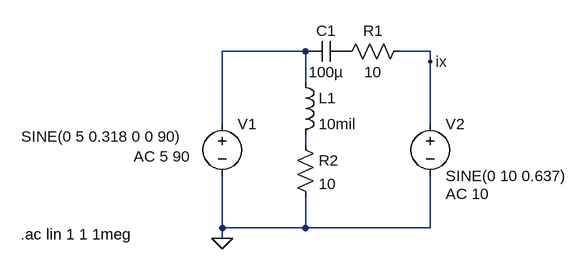
[diagram p0: schematic Task4.asc]
Task4.asc, the LTspice schematic file:
Version 4
SHEET 1 880 680
WIRE 224 48 96 48
WIRE 416 48 368 48
WIRE 416 64 416 48
WIRE 224 96 224 48
WIRE 96 160 96 48
WIRE 416 160 416 64
WIRE 224 192 224 176
WIRE 96 320 96 240
WIRE 224 320 224 272
WIRE 224 320 96 320
WIRE 416 320 416 240
WIRE 416 320 224 320
WIRE 96 336 96 320
FLAG 416 64 ix
FLAG 96 336 0
SYMBOL voltage 96 144 R0
WINDOW 3 -309 35 Left 2
WINDOW 123 -136 66 Left 2
WINDOW 39 0 0 Left 0
SYMATTR InstName V1
SYMATTR Value SINE(0 5 0.318 0 0 90)
SYMATTR Value2 AC 5 90
SYMBOL res 384 32 R90
WINDOW 0 0 56 VBottom 2
WINDOW 3 32 56 VTop 2
SYMATTR InstName R1
SYMATTR Value 10
SYMBOL res 208 176 R0
SYMATTR InstName R2
SYMATTR Value 10
SYMBOL cap 288 32 R90
WINDOW 0 0 32 VBottom 2
WINDOW 3 32 32 VTop 2
SYMATTR InstName C1
SYMATTR Value 100µ
SYMBOL ind 208 80 R0
SYMATTR InstName L1
SYMATTR Value 10mil
SYMBOL voltage 416 144 R0
WINDOW 123 24 124 Left 2
WINDOW 39 0 0 Left 0
SYMATTR InstName V2
SYMATTR Value SINE(0 10 0.637)
SYMATTR Value2 AC 10
TEXT -214 330 Left 2 !.ac lin 1 1 1meg

The netlist it stands for:
* Task4.asc
V1 N001 0 SINE(0 5 0.318 0 0 90) AC 5 90
R1 ix P001 10
R2 N002 0 10
C1 P001 N001 100µ
L1 N001 N002 10mil
V2 ix 0 SINE(0 10 0.637) AC 10
.ac lin 1 1 1meg
.backanno
.end